# Altium schematic sheet Extension_Board.SchDoc
size B
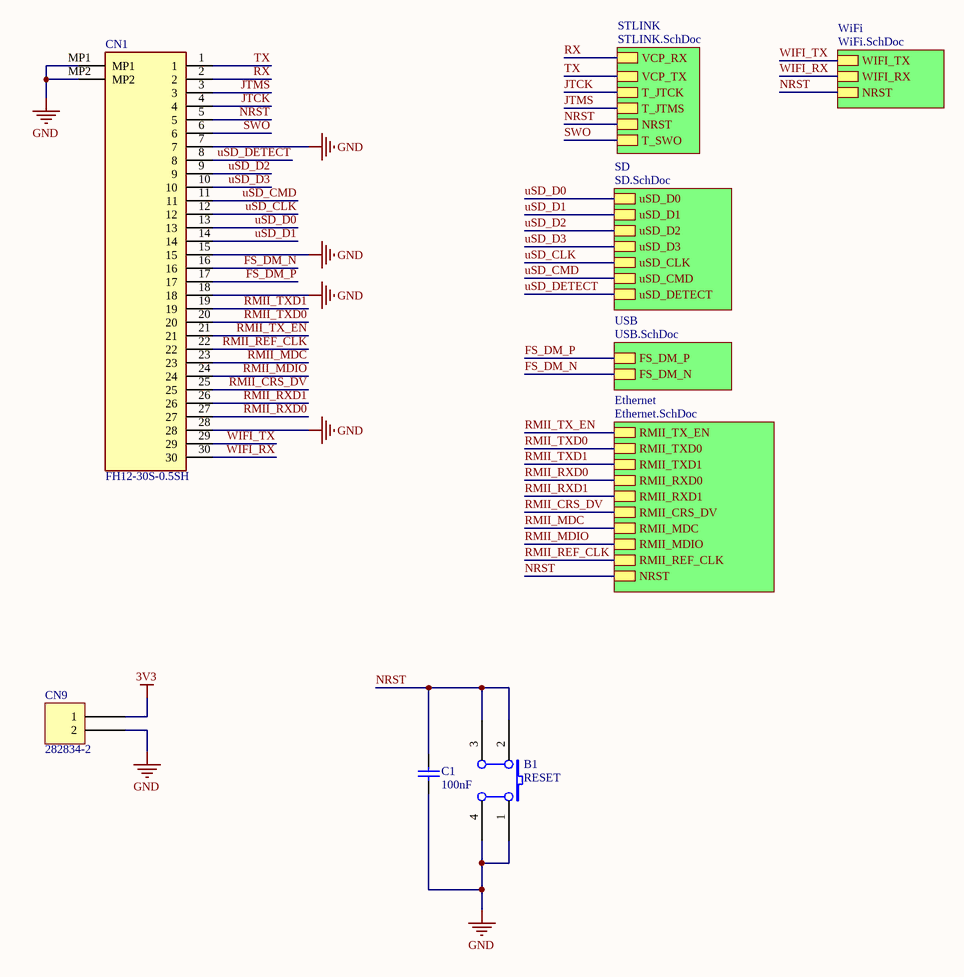
[diagram p0: Extension_Board.SchDoc]

## Parts
B1  RESET  [PB-6X6mm-Blue]
C1  value 100nF  [1608[0603]]  (hidden comment: Cap)
CN1  FH12-30S-0.5SH  [FH1230S05SH]
CN9  282834-2  [TE 282834-2]

## Sub-sheets
Ethernet = Ethernet.SchDoc: RMII_TX_EN, RMII_TXD0, RMII_TXD1, RMII_RXD0, RMII_RXD1, RMII_CRS_DV, RMII_MDC, RMII_MDIO, RMII_REF_CLK, NRST
SD = SD.SchDoc: uSD_D0, uSD_D1, uSD_D2, uSD_D3, uSD_CLK, uSD_CMD, uSD_DETECT
STLINK = STLINK.SchDoc: VCP_RX, VCP_TX, T_JTCK, T_JTMS, NRST, T_SWO
USB = USB.SchDoc: FS_DM_P, FS_DM_N
WiFi = WiFi.SchDoc: WIFI_TX, WIFI_RX, NRST

## Nets
3V3: CN9.1
GND: B1.1(A0) B1.4(A1) C1.2 CN1.7 CN1.15 CN1.18 CN1.28 CN1.MP1 CN1.MP2 CN9.2
FS_DM_N: CN1.16 ; sheet USB/FS_DM_N
FS_DM_P: CN1.17 ; sheet USB/FS_DM_P
JTCK: CN1.4 ; sheet STLINK/T_JTCK
JTMS: CN1.3 ; sheet STLINK/T_JTMS
NRST: B1.2(B0) B1.3(B1) C1.1 CN1.5 ; sheet STLINK/NRST, sheet Ethernet/NRST, sheet WiFi/NRST
RMII_CRS_DV: CN1.25 ; sheet Ethernet/RMII_CRS_DV
RMII_MDC: CN1.23 ; sheet Ethernet/RMII_MDC
RMII_MDIO: CN1.24 ; sheet Ethernet/RMII_MDIO
RMII_REF_CLK: CN1.22 ; sheet Ethernet/RMII_REF_CLK
RMII_RXD0: CN1.27 ; sheet Ethernet/RMII_RXD0
RMII_RXD1: CN1.26 ; sheet Ethernet/RMII_RXD1
RMII_TX_EN: CN1.21 ; sheet Ethernet/RMII_TX_EN
RMII_TXD0: CN1.20 ; sheet Ethernet/RMII_TXD0
RMII_TXD1: CN1.19 ; sheet Ethernet/RMII_TXD1
RX: CN1.2 ; sheet STLINK/VCP_RX
SWO: CN1.6 ; sheet STLINK/T_SWO
TX: CN1.1 ; sheet STLINK/VCP_TX
uSD_CLK: CN1.12 ; sheet SD/uSD_CLK
uSD_CMD: CN1.11 ; sheet SD/uSD_CMD
uSD_D0: CN1.13 ; sheet SD/uSD_D0
uSD_D1: CN1.14 ; sheet SD/uSD_D1
uSD_D2: CN1.9 ; sheet SD/uSD_D2
uSD_D3: CN1.10 ; sheet SD/uSD_D3
uSD_DETECT: CN1.8 ; sheet SD/uSD_DETECT
WIFI_RX: CN1.30 ; sheet WiFi/WIFI_RX
WIFI_TX: CN1.29 ; sheet WiFi/WIFI_TX

## Library data of the parts
B1 = SW PUSHBUTTON: SE PUSHBUTTON
C1 = Cap: Capacitor; Published: 8-Jun-2000; LatestRevisionDate: 17-Jul-2002; LatestRevisionNote: Re-released for DXP Platform.; PackageReference: RAD-0.3; Publisher: Altium Limited; PackageDescription: Radial Cap, Thru-Hole; 2 Leads; 0.3 in Pin Spacing
CN1 = FH12-30S-0.5SH: Connector; Manufacturer_Name: Hirose; Datasheet Link: https://datasheet.datasheetarchive.com/originals/dk/DKDS-2/23451.pdf; Height: 4.8mm; Manufacturer_Part_Number: FH12-30S-0.5SH
CN9 = 282834-2: TERM BLK 2P SIDE ENT 2.54MM PCB; Manufacturer: TE Connectivity AMP Connectors; Current: 10A; Mating Orientation: Horizontal with Board; Number of Levels: 1; Pitch: 0.100" (2.54mm); Positions Per Level: 2; Voltage: 150V; Wire Gauge: 16-30 AWG; Wire Termination: Screw - Rising Cage Clamp; Part Number: 282834-2; Color: Green; ComponentLink1Description: Datasheet; ComponentLink1URL: https://www.te.com/commerce/DocumentDelivery/DDEController?Action=srchrtrv&DocNm=282834&DocType=Customer+Drawing&DocLang=English; ComponentLink2Description: DigiKey Link; ComponentLink2URL: http://digikey.com/product-detail/en/te-connectivity-amp-connectors/282834-2/A98333-ND/1150135; LastUpdated: 1/15/2020 4:15:38 AM; Lifecycle Status: Active; Minimum Order: 1; Mounting Type: Through Hole; Packaging: Bulk; Part Status: Active; Price: 0.88; Series: Buchanan; Supplier 1: DigiKey; Supplier Part Number 1: A98333-ND